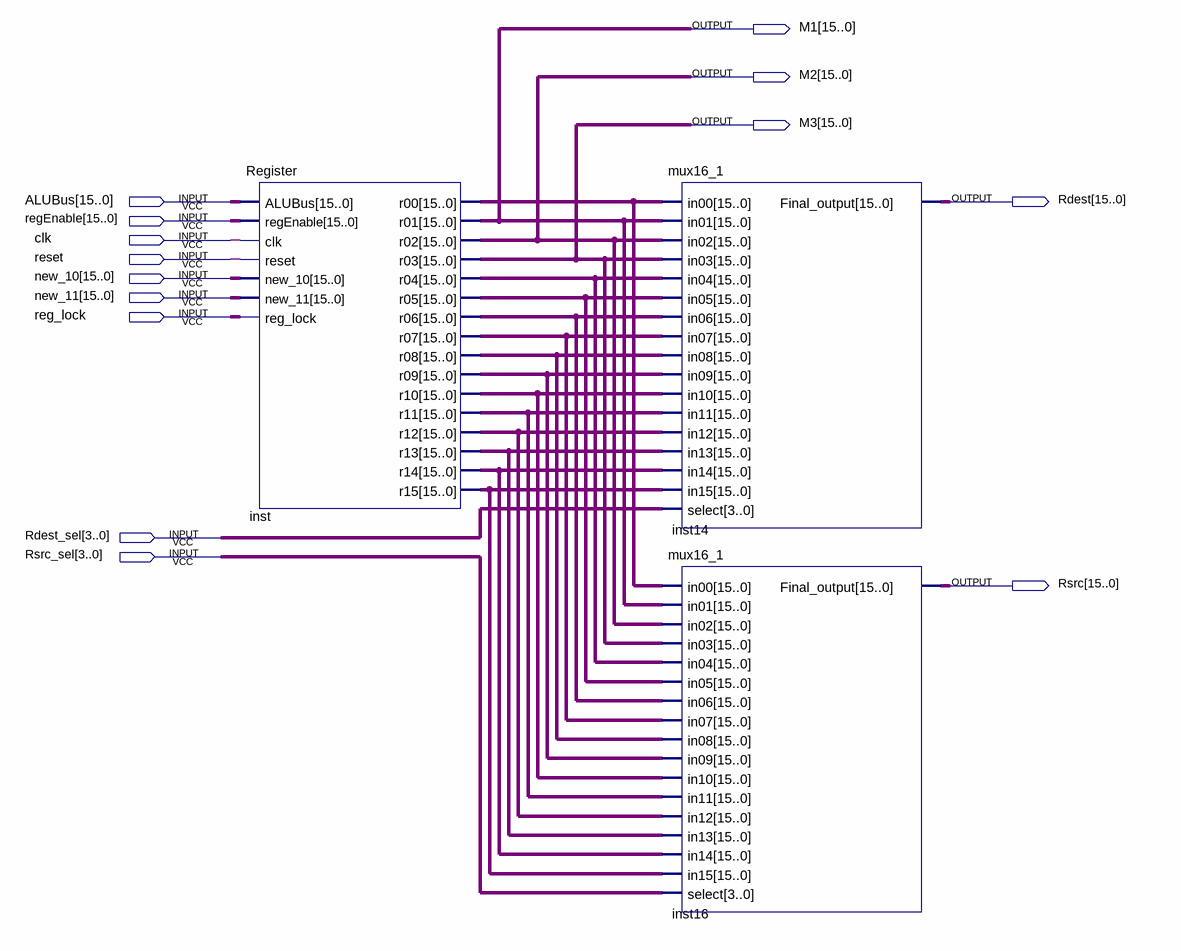
[diagram p0: schematic sheet]
// Quartus schematic REGISTERS.bdf as structural Verilog: 3 symbols, 14 pins
module REGISTERS (
  input  [15:0] ALUBus,
  input  [15:0] regEnable,
  input  clk,
  input  reset,
  input  [15:0] new_10,
  input  [15:0] new_11,
  input  reg_lock,
  input  [3:0] Rdest_sel,
  input  [3:0] Rsrc_sel,
  output [15:0] M1,
  output [15:0] M2,
  output [15:0] M3,
  output [15:0] Rdest,
  output [15:0] Rsrc
);

  wire [15:0] inst_r00, inst_r04, inst_r05, inst_r06, inst_r07, inst_r08, inst_r09, inst_r10, inst_r11,
       inst_r12, inst_r13, inst_r14, inst_r15;

  Register inst (
    .ALUBus(ALUBus), .regEnable(regEnable), .clk(clk), .reset(reset), .new_10(new_10), .new_11(new_11),
    .reg_lock(reg_lock), .r00(inst_r00), .r01(M1), .r02(M2), .r03(M3), .r04(inst_r04), .r05(inst_r05),
    .r06(inst_r06), .r07(inst_r07), .r08(inst_r08), .r09(inst_r09), .r10(inst_r10), .r11(inst_r11),
    .r12(inst_r12), .r13(inst_r13), .r14(inst_r14), .r15(inst_r15));
  mux16_1 inst14 (
    .in00(inst_r00), .in01(M1), .in02(M2), .in03(M3), .in04(inst_r04), .in05(inst_r05), .in06(inst_r06),
    .in07(inst_r07), .in08(inst_r08), .in09(inst_r09), .in10(inst_r10), .in11(inst_r11), .in12(inst_r12),
    .in13(inst_r13), .in14(inst_r14), .in15(inst_r15), .select(Rdest_sel), .Final_output(Rdest));
  mux16_1 inst16 (
    .in00(inst_r00), .in01(M1), .in02(M2), .in03(M3), .in04(inst_r04), .in05(inst_r05), .in06(inst_r06),
    .in07(inst_r07), .in08(inst_r08), .in09(inst_r09), .in10(inst_r10), .in11(inst_r11), .in12(inst_r12),
    .in13(inst_r13), .in14(inst_r14), .in15(inst_r15), .select(Rsrc_sel), .Final_output(Rsrc));
endmodule
